# EAGLE design esp32s_breakout (EAGLE 7.4.0)
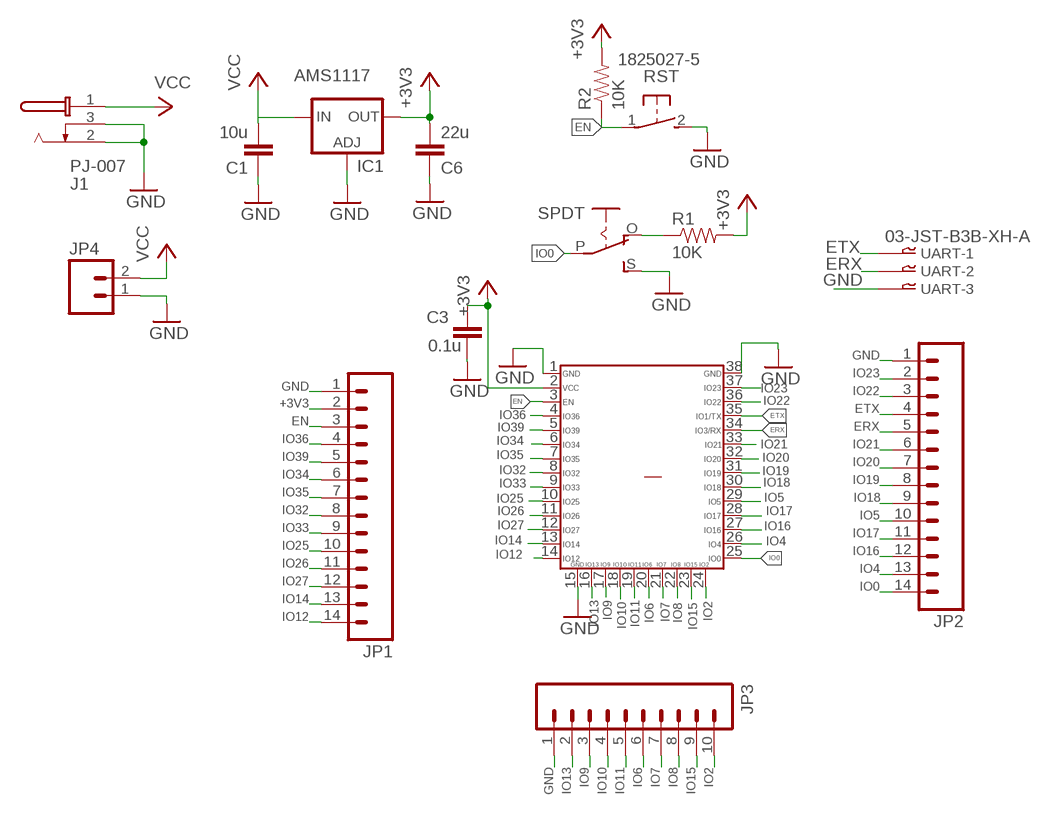
[diagram p0: schematic, sheet 1]

## Parts
C1  10u  CAP0805-CAP-LARGEPADS  [0805-CAP-LARGEPADS]
C3  0.1u  CAP0805  [0805]
C6  22u  CAP0805  [0805]
IC1  AMS1117  LD117AS33TR  [SOT223]
J1  PJ-007  [PJ-007]
JP1  M14  [1X14]
JP2  M14  [1X14]
JP3  M10SILK_FEMALE_PTH  [1X10]
JP4  M02PTH  [1X02]
R1  10K  RESISTOR0805  [0805]
R2  10K  RESISTOR0805  [0805]
RST  1825027-XBLK-152  [1825027-152]
SPDT  EG1218S  [EG1218]
U$1  ESP32S32S  [ESP32]
UART  03-JST-B3B-XH-A  [B3B-XH]

## Nets
+3V3 [power]: C3.1 C6.2 IC1.4(OUT) JP1.2 R1.2 R2.2 U$1.2
EN: JP1.3 R2.1 RST.1(P) U$1.3
ERX: JP2.5 U$1.34 UART.P$2
ETX: JP2.4 U$1.35 UART.P$1
GND: C1.1 C3.2 C6.1 IC1.1(ADJ) J1.2(S) J1.3(SS) JP1.1 JP2.1 JP3.1 JP4.1 RST.2(S) SPDT.S U$1.1 U$1.15 U$1.38 UART.P$3
IO0: JP2.14 SPDT.P U$1.25
IO2: JP3.10 U$1.24
IO4: JP2.13 U$1.26
IO5: JP2.10 U$1.29
IO6: JP3.6 U$1.20
IO7: JP3.7 U$1.21
IO8: JP3.8 U$1.22
IO9: JP3.3 U$1.17
IO10: JP3.4 U$1.18
IO11: JP3.5 U$1.19
IO12: JP1.14 U$1.14
IO13: JP3.2 U$1.16
IO14: JP1.13 U$1.13
IO15: JP3.9 U$1.23
IO16: JP2.12 U$1.27
IO17: JP2.11 U$1.28
IO18: JP2.9 U$1.30
IO19: JP2.8 U$1.31
IO20: JP2.7 U$1.32
IO21: JP2.6 U$1.33
IO22: JP2.3 U$1.36
IO23: JP2.2 U$1.37
IO25: JP1.10 U$1.10
IO26: JP1.11 U$1.11
IO27: JP1.12 U$1.12
IO32: JP1.8 U$1.8
IO33: JP1.9 U$1.9
IO34: JP1.6 U$1.6
IO35: JP1.7 U$1.7
IO36: JP1.4 U$1.4
IO39: JP1.5 U$1.5
N$55: R1.1 SPDT.O
VCC [power]: C1.2 IC1.3(IN) J1.1(T) JP4.2

## Notes on the sheet
- 1825027-5

## Power pins joined to a net without a drawn wire
P$39: U$1.GNDTHRM

## Library data of the parts
C1 C3 C6 = FlumeHW:CAP: Capacitor Standard 0603 ceramic capacitor, and 0.1" leaded capacitor.
IC1 = v-reg:LD117A?*: Low drop fixed and adjustable positive voltage regulators 1 A Source: http://www.st.com/stonline/products/literature/ds/7194/ld1117axx.pdf
J1 = con-cruistack:PJ-007: DC Power Jack PJ-007 (1.3 MM)
JP1 JP2 = SparkFun-Connectors:M14: Header 14 Standard 14-pin 0.1" header. Use with straight break away headers (SKU : PRT-00116), right angle break away headers (PRT-00553), swiss pins (PRT-00743), machine pins (PRT-00117), and female headers (PRT-00115).
JP3 = SparkFun-Connectors:M10: Header 10 Standard 10-pin 0.1" header. Use with straight break away headers (SKU : PRT-00116), right angle break away headers (PRT-00553), swiss pins (PRT-00743), machine pins (PRT-00117), and female headers (PRT-00115).; PROD_ID: CONN-11563
JP4 = SparkFun-Connectors:M02: Standard 2-pin 0.1" header. Use with - straight break away headers ( PRT-00116) - right angle break away headers (PRT-00553) - swiss pins (PRT-00743) - machine pins (PRT-00117) - female headers (PRT-00115) Molex polarized connector foot print use with: PRT-08233 with associated crimp pins and housings. 2.54_SCREWTERM for use with PRT-10571. 3.5mm Screw Terminal footprints for PRT-08084 5mm Screw Terminal footprints for use with PRT-08432
R1 R2 = FlumeHW:RESISTOR: Resistor Basic schematic elements and footprints for 0603, 1206, and PTH resistors.
RST = FlumeHW:1825027-X: OMRON SWITCH Now with beefier pads!
SPDT = adafruit:EG1218: SLIDING SWITCH 0.1" spacing through hole, vertical SPDT slide switch http://www.ladyada.net/library/pcb/eaglelibrary.html
U$1 = FlumeHW:ESP32S
UART = con-jst-xh:03-JST: JST CONNECTOR

## Net classes
1 power: width 0.381 mm, clearance 0.254 mm

## Board
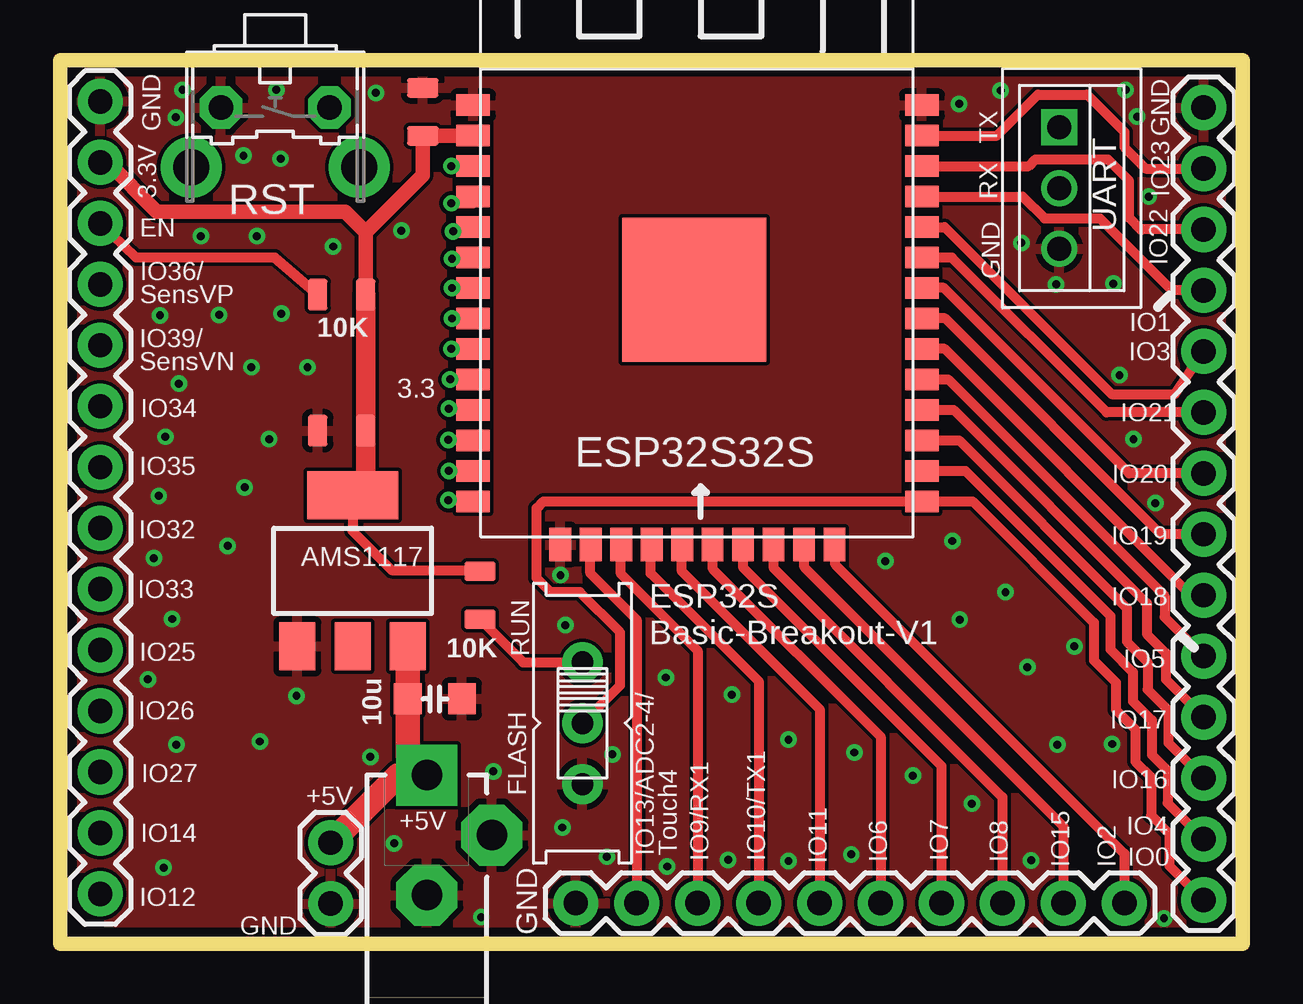
[diagram p1: board, top side]
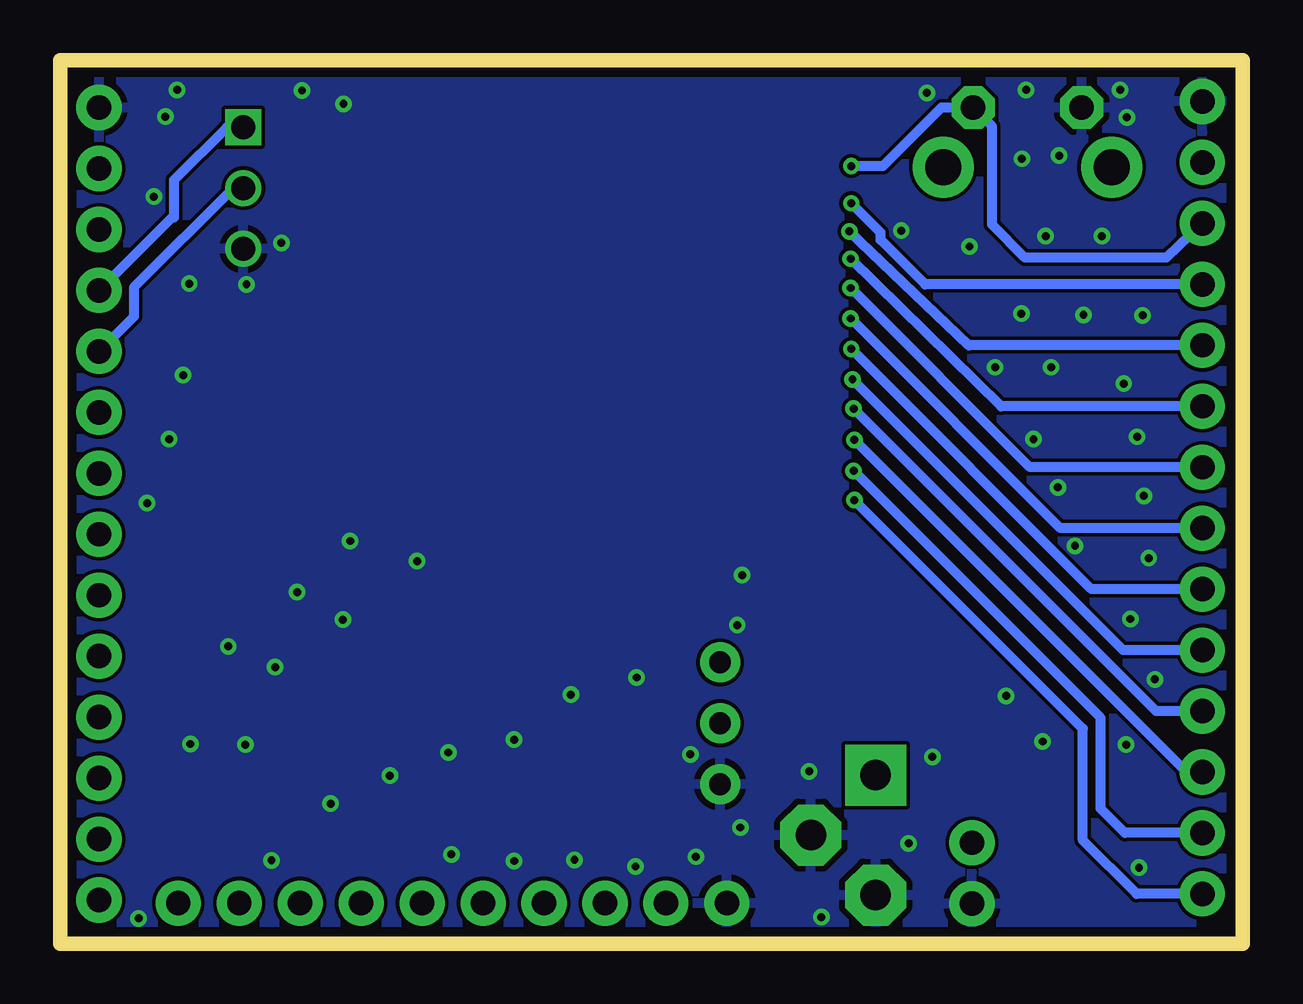
[diagram p2: board, bottom side, seen from below]

Size 49.28 x 36.83 mm. Coordinates in mm from the lower left corner, seen from the top.
Outline: 0,36.83 0,0 49.28,0 49.28,36.83 0,36.83
Copper layers (1*16): Top 0.0356mm / dielectric 1.5011mm / Bottom 0.0356mm
Design rules "oshpark-2layer *": minimum track width 6mil, minimum drill 13mil, track to track 6mil, track to pad 6mil, pad to pad 6mil, via to via 6mil, smd to smd 0mil, copper to edge 15mil, drill to drill 6mil, minimum pad ring 7mil, minimum via ring 7mil, stop-mask expansion 2.5mil, vias tented up to drill 0mil, thermal gap 10mil

### Footprints (pad centres in the part's own frame; a part is rotated, then mirrored left to right if it is on the bottom)
0805-CAP-LARGEPADS = smd 1.156 x 1.3: 1 -1.127,0; 2 1.127,0
0805 = smd 0.8 x 1.3: 1 -1,0; 2 1,0
SOT223 = smd 1.5 x 2: 1 -2.3,-3.15; 2 0,-3.15; 3 2.3,-3.15 | smd 3.8 x 2: 4 0,3.15
PJ-007 = drill 1.27 pad 2.54 square: 1 0,0 | drill 1.27 pad 2.54 octagon: 2 0,-5; 3 2.7,-2.5
1X14 = drill 1.016 pad 1.88: 1 0,0; 2 2.54,0; 3 5.08,0; 4 7.62,0; 5 10.16,0; 6 12.7,0; 7 15.24,0; 8 17.78,0; 9 20.32,0; 10 22.86,0; 11 25.4,0; 12 27.94,0; 13 30.48,0; 14 33.02,0
1X10 = drill 1.016 pad 1.88: 1 0,0; 2 2.54,0; 3 5.08,0; 4 7.62,0; 5 10.16,0; 6 12.7,0; 7 15.24,0; 8 17.78,0; 9 20.32,0; 10 22.86,0
1X02 = drill 1.016 pad 1.88: 1 0,0; 2 2.54,0
1825027-152 = drill 1.016 pad 1.778 octagon: 1 -2.261,-1.245; 2 2.261,-1.245 | drill 1.499 pad 2.54: 3 -3.505,1.245; 4 3.505,1.245
EG1218 = drill 0.9 pad 1.676: O -2.54,0; P 0,0; S 2.54,0
ESP32 = smd 1.4 x 0.9: 1 0.68,19.99; 2 0.68,18.72; 3 0.68,17.45; 4 0.68,16.18; 5 0.68,14.91; 6 0.68,13.64; 7 0.68,12.37; 8 0.68,11.1; 9 0.68,9.83; 10 0.68,8.56; 11 0.68,7.29; 12 0.68,6.02; 13 0.68,4.75; 14 0.68,3.48; 25 19.38,3.48; 26 19.38,4.75; 27 19.38,6.02; 28 19.38,7.29; 29 19.38,8.56; 30 19.38,9.83; 31 19.38,11.1; 32 19.38,12.37; 33 19.38,13.64; 34 19.38,14.91; 35 19.38,16.18; 36 19.38,17.45; 37 19.38,18.72; 38 19.38,19.99 | smd 0.9 x 1.4: 15 4.31,1.68; 16 5.58,1.68; 17 6.85,1.68; 18 8.12,1.68; 19 9.39,1.68; 20 10.66,1.68; 21 11.93,1.68; 22 13.2,1.68; 23 14.47,1.68; 24 15.74,1.68 | smd 6 x 6: GNDTHRM 9.9,12.3
B3B-XH = drill 1 square: P$1 -2.54,0 | drill 1: P$2 0,0; P$3 2.54,0

### Placement (x,y rotation side)
C1  15.62,10.21 180 top
C3  15.11,34.67 90 top
C6  11.73,21.39 0 top
IC1  12.19,15.54 0 top
J1  15.29,7.04 0 top
JP1  1.68,35.1 270 top
JP2  47.65,34.85 270 top
JP3  21.49,1.7 0 top
JP4  11.28,1.68 90 top
R1  17.5,14.53 90 top
R2  11.73,27.05 0 top
RST  8.97,33.6 180 top
SPDT  21.77,9.19 270 top
U$1  16.54,14.96 0 top
UART  41.63,31.5 270 top

### Tracks (layer width: path | path; a pad name or v marks a point on that pad's centre or on a via)
+3V3
  Top 0.406: IC1.4 12.19,17.2 13.82,15.57 17.46,15.57 R1.2
  Top 0.61: U$1.2 15.12,33.68 C3.1 15.11,32.03 12.73,29.65 | R2.2 12.73,29.65 | JP1.2 1.98,32.56 4.04,30.5 11.88,30.5 12.73,29.65
  Top 0.813: IC1.4 12.73,19.24 C6.2 R2.2
EN  (via drill 0.33)
  Top 0.406: R2.1 8.96,28.6 3.18,28.6 JP1.3 | v16.31,32.41 U$1.3
  Bottom 0.406: JP1.3 3.18,28.6 9.07,28.6 10.44,29.97 10.44,34.06 RST.1 12.55,34.85 14.99,32.41 v16.31,32.41
ERX
  Top 0.406: U$1.34 36.86,29.87 43.81,22.91 46.46,22.91 JP2.5
  Bottom 0.406: UART.P$2 42.06,31.5 46.2,27.36 46.2,26.14 JP2.5
ETX
  Top 0.406: U$1.35 40.11,31.14 41.02,30.23 43.33,30.23 46.33,27.23 JP2.4
  Bottom 0.406: UART.P$1 42.32,34.04 44.53,31.83 44.53,30.28 44.6,30.28 JP2.4
GND  (via drill 0.33)
  other vias: 4.85,8.31 7.98,24.03 44.15,23.7 4.32,3.18 40.31,11.53 43.89,27.51 44.4,35.59 41.5,27.48 7.65,32.84 4.83,34.44 18.06,7.19 25.3,3.23 39.19,35.56 45.36,31.14 44.88,34.47 45.64,18.36 44.73,21.03 42.27,12.4 41.55,8.31 6.98,16.59 37.19,16.79 8.71,21.03 4.95,23.34 13.16,35.46 9.19,32.72 9.02,35.59 5.11,35.59 21.06,13.28 3.91,16.08 22.78,3.63 4.67,13.54 34.39,15.95 4.11,18.67 43.84,8.33 3.66,11.02 40.06,29.21 46,1.07 39.4,14.66 20.85,15.37 4.17,26.19 6.63,26.21 9.22,26.26 10.31,24.03 11.38,29.06 27.99,10.39 27.84,3.51 37.49,13.51 33.1,7.98 30.35,3.45 30.35,8.51 23.01,7.9 35.53,7.01 38,5.84 8.33,8.43 13.92,4.19 12.93,7.8 14.22,29.72 7.7,19.02 4.39,21.13 8.2,29.49 5.87,29.49 25.25,11.1 20.93,4.85 17.55,1.12 32.97,3.73 40.46,3.48 37.47,35 9.86,10.34
  pour Top (rank 4): 50.44,37.92 50.6,-1.22 -1.55,-1.04 -1.5,38.15
  pour Bottom: -0.81,37.49 49.86,37.31 49.96,-0.63 -0.91,-0.43
IO0
  Top 0.406: SPDT.P 23.34,10.77 23.34,12.98 21.67,14.66 20.45,14.66 19.86,15.24 19.86,18.16 20.14,18.44 U$1.25 38.02,18.44 43.08,13.39 43.08,11.81 43.99,10.9 43.99,9.75 44.81,8.94 44.81,7.6 45.47,6.93 45.47,5.36 46.23,4.6 46.23,3.25 JP2.14
IO2
  Top 0.406: U$1.24 32.31,16.61 32.31,15.8 44.35,3.76 JP3.10
IO4
  Top 0.406: U$1.26 37.72,19.71 43.76,13.67 43.76,12.27 44.7,11.33 44.7,10.11 45.49,9.32 45.49,7.87 46.15,7.21 46.15,5.87 JP2.13
IO5
  Top 0.406: U$1.29 37.01,23.52 46.03,14.5 46.03,13.61 JP2.10
IO6
  Top 0.406: U$1.20 27.2,15.62 34.19,8.64 JP3.6
IO7
  Top 0.406: U$1.21 28.47,15.67 36.73,7.42 JP3.7
IO8
  Top 0.406: U$1.22 29.74,15.65 39.27,6.12 JP3.8
IO9
  Top 0.406: U$1.17 23.37,16.62 23.37,15.42 26.57,12.22 JP3.3
IO10
  Top 0.406: U$1.18 24.61,16.6 24.61,15.44 29.11,10.95 JP3.4
IO11
  Top 0.406: U$1.19 25.91,16.62 25.91,15.52 31.65,9.78 JP3.5
IO12  (via drill 0.33)
  Top 0.406: v16.18,18.49 17.16,18.49 U$1.14
  Bottom 0.406: JP1.14 4.42,2.08 6.65,4.32 6.65,8.97 v16.18,18.49
IO13
  Top 0.406: U$1.16 22.1,16.62 22.1,15.44 24.03,13.51 JP3.2
IO14  (via drill 0.33)
  Top 0.406: v16.2,19.71 U$1.13
  Bottom 0.406: JP1.13 4.9,4.62 5.92,5.64 5.92,9.42 v16.2,19.71
IO15
  Top 0.406: U$1.23 31.01,15.7 41.81,4.9 JP3.9
IO16
  Top 0.406: U$1.27 37.47,20.98 44.45,13.99 44.45,12.6 45.31,11.74 45.31,10.59 46.18,9.73 46.18,8.38 JP2.12
IO17
  Top 0.406: U$1.28 37.24,22.25 45.29,14.2 45.29,12.9 46.08,12.12 46.08,11.02 JP2.11
IO18
  Top 0.406: JP2.9 47.12,14.53 36.86,24.79 U$1.30
IO19
  Top 0.406: JP2.8 45.87,17.07 36.88,26.06 U$1.31
IO20
  Top 0.406: JP2.7 44.55,19.61 36.83,27.33 U$1.32
IO21
  Top 0.406: JP2.6 43.61,22.15 37.16,28.6 U$1.33
IO22
  Top 0.406: U$1.36 40.36,32.41 40.64,32.69 43.66,32.69 44.53,31.83 44.53,30.28 45.06,29.74 45.08,29.77 JP2.3
IO23
  Top 0.406: U$1.37 39.04,33.68 40.74,35.38 42.8,35.38 44.35,33.83 44.35,33.2 45.24,32.31 JP2.2
IO25  (via drill 0.33)
  Top 0.406: v16.26,23.52 U$1.10
  Bottom 0.406: JP1.10 4.98,12.24 v16.26,23.52
IO26  (via drill 0.33)
  Top 0.406: v16.2,22.3 17.16,22.3 U$1.11
  Bottom 0.406: JP1.11 3.61,9.7 v16.2,22.3
IO27  (via drill 0.33)
  Top 0.406: v16.18,21.01 17.19,21.01 U$1.12
  Bottom 0.406: JP1.12 2.34,7.16 v16.18,21.01
IO32  (via drill 0.33)
  Top 0.406: U$1.8 | v16.33,26.06 U$1.8
  Bottom 0.406: JP1.8 7.6,17.32 v16.33,26.06
IO33  (via drill 0.33)
  Top 0.406: v16.31,24.79 U$1.9
  Bottom 0.406: JP1.9 6.3,14.78 v16.31,24.79
IO34  (via drill 0.33)
  Top 0.406: U$1.6 17.21,28.55 v16.33,28.55
  Bottom 0.406: JP1.6 10.06,22.4 v16.33,28.55
IO35  (via drill 0.33)
  Top 0.406: U$1.7 | v16.33,27.33 U$1.7
  Bottom 0.406: JP1.7 8.87,19.86 v16.33,27.33
IO36  (via drill 0.33)
  Top 0.406: 17.19,31.11 U$1.4 17.21,30.86 v16.31,30.86
  Bottom 0.406: v16.31,30.86 15.09,29.64 15.09,29.34 13.23,27.48 JP1.4
IO39  (via drill 0.33)
  Top 0.406: 17.19,29.9 U$1.5 17.21,29.69 v16.38,29.69
  Bottom 0.406: JP1.5 11.41,24.94 v16.38,29.69
N$55
  Top 0.406: R1.1 19.29,11.74 SPDT.O
VCC
  Top 1.016: JP4.2 14.1,7.04 J1.1 14.49,7.83 C1.2 IC1.3

### Text on the board
tNames: GND | GND | TX | IO23 | RX | 3.3V | GND | IO22 | EN | IO36/ / SensVP | IO1 | IO39/ / SensVN | IO3 | 3.3 | IO34 | IO21 | IO20 | IO35 | IO32 | IO19 | IO18 | IO33 | RUN | IO25 | ESP32S / Basic-Breakout-V1 | IO5 | IO26 | IO17 | IO16 | IO27 | +5V | FLASH | +5V | IO4 | IO14 | IO0 | GND | IO13/ADC2-4/ / Touch4 | IO9/RX1 | IO10/TX1 | IO11 | IO6 | IO7 | IO8 | IO15 | IO2 | IO12 | GND